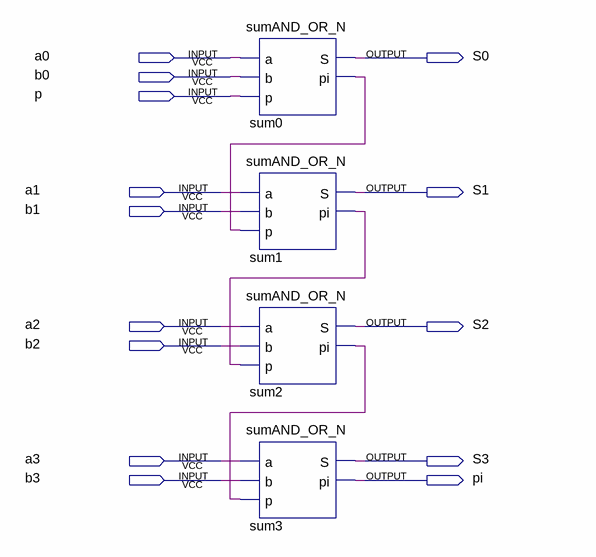
[diagram p0: schematic sheet]
// Quartus schematic Lab4.bdf as structural Verilog: 4 symbols, 14 pins
module Lab4 (
  input  a0,
  input  b0,
  input  p,
  input  a1,
  input  b1,
  input  a2,
  input  b2,
  input  a3,
  input  b3,
  output S0,
  output S1,
  output S2,
  output S3,
  output pi
);

  wire sum0_pi, sum1_pi, sum2_pi;

  sumAND_OR_N sum0 (.a(a0), .b(b0), .p(p), .S(S0), .pi(sum0_pi));
  sumAND_OR_N sum1 (.a(a1), .b(b1), .p(sum0_pi), .S(S1), .pi(sum1_pi));
  sumAND_OR_N sum2 (.a(a2), .b(b2), .p(sum1_pi), .S(S2), .pi(sum2_pi));
  sumAND_OR_N sum3 (.a(a3), .b(b3), .p(sum2_pi), .S(S3), .pi(pi));
endmodule
